# Altium schematic sheet FPC-isoIOs-IOpQuad.SchDoc
size A4; SheetNumber: 7; SheetTotal: 15
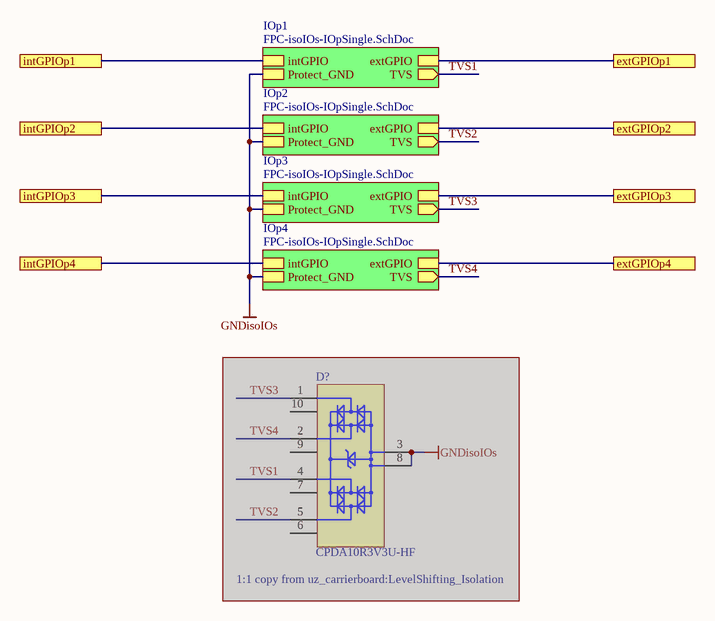
[diagram p0: FPC-isoIOs-IOpQuad.SchDoc]

## Parts
D?  CPDA10R3V3U-HF  [DFN230X100X55X10N]  (masked out: inside a compile mask, not in the netlist)

## Sub-sheets
IOp1 = FPC-isoIOs-IOpSingle.SchDoc: extGPIO, intGPIO, TVS (out), Protect_GND
IOp2 = FPC-isoIOs-IOpSingle.SchDoc: extGPIO, intGPIO, TVS (out), Protect_GND
IOp3 = FPC-isoIOs-IOpSingle.SchDoc: extGPIO, intGPIO, TVS (out), Protect_GND
IOp4 = FPC-isoIOs-IOpSingle.SchDoc: extGPIO, intGPIO, TVS (out), Protect_GND

## Ports
extGPIOp1, extGPIOp2, extGPIOp3, extGPIOp4, intGPIOp1, intGPIOp2, intGPIOp3, intGPIOp4

## Nets
GNDisoIOs: sheet IOp1/Protect_GND, sheet IOp2/Protect_GND, sheet IOp3/Protect_GND, sheet IOp4/Protect_GND
extGPIOp1: port extGPIOp1, sheet IOp1/extGPIO
extGPIOp2: port extGPIOp2, sheet IOp2/extGPIO
extGPIOp3: port extGPIOp3, sheet IOp3/extGPIO
extGPIOp4: port extGPIOp4, sheet IOp4/extGPIO
intGPIOp1: port intGPIOp1, sheet IOp1/intGPIO
intGPIOp2: port intGPIOp2, sheet IOp2/intGPIO
intGPIOp3: port intGPIOp3, sheet IOp3/intGPIO
intGPIOp4: port intGPIOp4, sheet IOp4/intGPIO
TVS1: sheet IOp1/TVS
TVS2: sheet IOp2/TVS
TVS3: sheet IOp3/TVS
TVS4: sheet IOp4/TVS

## Notes on the sheet
- (near D?) 1:1 copy from uz_carrierboard:LevelShifting_Isolation
- Title
- Revision:
- Design Engineer:
- Date:
- Project:
- Sheet
- of

## Library data of the parts
D? = 29054: AN: 29054; Voltage: 3.3V; Mixed: SMT; Temperature-Range: -55/+125; Extra: Diode Array TVS Diode ESD Protection 4-channel; Case: TSLP-9-1; HelpURL: b:\AD\adlib\datasheet\CPDA10R3V3U-HF\; H-ART: CPDA10R3V3U-HF